# EAGLE design Мультивибратор (EAGLE 9.1.3)
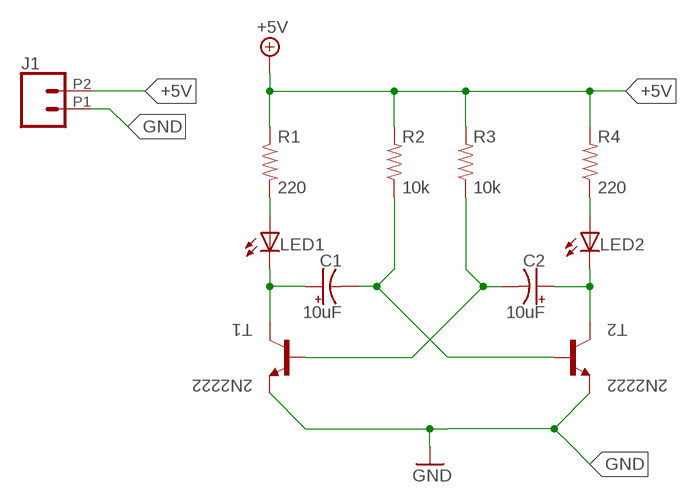
[diagram p0: schematic, sheet 1]

## Parts
C1  10uF  10UF-POLAR-RADIAL-2.5MM-25V-20%  [CPOL-RADIAL-2.5MM-5MM]
C2  10uF  10UF-POLAR-RADIAL-2.5MM-25V-20%  [CPOL-RADIAL-2.5MM-5MM]
J1  CONN_022.54MM_SCREWTERM  [1X02_2.54_SCREWTERM]
LED1  LED5MM  [LED5MM]
LED2  LED5MM  [LED5MM]
R1  220  100OHM-HORIZ-1/4W-1%  [AXIAL-0.3]
R2  10k  100OHM-HORIZ-1/4W-1%  [AXIAL-0.3]
R3  10k  100OHM-HORIZ-1/4W-1%  [AXIAL-0.3]
R4  220  100OHM-HORIZ-1/4W-1%  [AXIAL-0.3]
T1  2N2222  [TO92-EBC-OVAL]
T2  2N2222  [TO92-EBC-OVAL]

## Nets
+5V: J1.P2 R1.P$1 R2.P$2 R3.P$2 R4.P$2
GND: J1.P1 T1.E T2.E
N$1: LED1.A R1.P$2
N$2: C1.1(+) LED1.K(C) T1.C
N$3: C2.1(+) LED2.K(C) T2.C
N$4: LED2.A R4.P$1
N$5: C1.2(-) R2.P$1 T2.B
N$6: C2.2(-) R3.P$1 T1.B

## Library data of the parts
C1 C2 = SparkFun-Capacitors:10UF-POLAR: 10.0µF polarized capacitors A capacitor is a passive two-terminal electrical component used to store electrical energy temporarily in an electric field.; PROD_ID: CAP-08440
J1 = SparkFun-Connectors:CONN_02: Multi connection point. Often used as Generic Header-pin footprint for 0.1 inch spaced/style header connections On any of the 0.1 inch spaced packages, you can populate with these: Break Away Headers - Straight <https://www.sparkfun.com/products/116> (PRT-00116) Break Away Male Headers - Right Angle <https://www.sparkfun.com/products/553> (PRT-00553) Female Headers <https://www.sparkfun.com/products/115> (PRT-00115) Break Away Headers - Machine Pin <https://www.sparkfun.com/products/117> (PRT-00117) Break Away Female Headers - Swiss Machine Pin <https://www.sparkfun.com/products/743> (PRT-00743) For SCREWTERMINALS and SPRING TERMINALS visit here: Screw Terimnals on SparkFun.com <https://www.sparkfun.com/search/results?term=Screw+Terminals> (5mm/3.5mm/2.54mm spacing) This device is also useful as a general connection point to wire up your design to another part of your project. Our various solder wires solder well into these plated through hole pads. Hook-Up Wire - Assortment (Stranded, 22 AWG) <https://www.sparkfun.com/products/11375> (PRT-11375) Hook-Up Wire - Assortment (Solid Core, 22 AWG) <https://www.sparkfun.com/products/11367> (PRT-11367) View the entire wire category on our website here <https://www.sparkfun.com/categories/141> Special notes: Molex polarized connector foot print use with: PRT-08233 with associated crimp pins and housings. 2.54_SCREWTERM for use with PRT-10571. 3.5mm Screw Terminal footprints for PRT-08084 5mm Screw Terminal footprints for use with PRT-08432
LED1 LED2 = adafruit:LED: LED OSRAM: - CHIPLED LG R971, LG N971, LY N971, LG Q971, LY Q971, LO R971, LY R971 LH N974, LH R974 LS Q976, LO Q976, LY Q976 LO Q996 - Hyper CHIPLED LW Q18S LB Q993, LB Q99A, LB R99A - SideLED LS A670, LO A670, LY A670, LG A670, LP A670 LB A673, LV A673, LT A673, LW A673 LH A674 LY A675 LS A676, LA A676, LO A676, LY A676, LW A676 LS A679, LY A679, LG A679 - Hyper Micro SIDELED® LS Y876, LA Y876, LO Y876, LY Y876 LT Y87S - SmartLED LW L88C, LW L88S LB L89C, LB L89S, LG L890 LS L89K, LO L89K, LY L89K LS L896, LA L896, LO L896, LY L896 - TOPLED LS T670, LO T670, LY T670, LG T670, LP T670 LSG T670, LSP T670, LSY T670, LOP T670, LYG T670 LG T671, LOG T671, LSG T671 LB T673, LV T673, LT T673, LW T673 LH T674 LS T676, LA T676, LO T676, LY T676, LB T676, LH T676, LSB T676, LW T676 LB T67C, LV T67C, LT T67C, LS T67K, LO T67K, LY T67K, LW E67C LS E67B, LA E67B, LO E67B, LY E67B, LB E67C, LV E67C, LT E67C LW T67C LS T679, LY T679, LG T679 LS T770, LO T770, LY T770, LG T770, LP T770 LB T773, LV T773, LT T773, LW T773 LH T774 LS E675, LA E675, LY E675, LS T675 LS T776, LA T776, LO T776, LY T776, LB T776 LHGB T686 LT T68C, LB T68C - Hyper Mini TOPLED® LB M676 - Mini TOPLED Santana® LG M470 LS M47K, LO M47K, LY M47K Source: http://www.osram.convergy.de/
R1-R4 = SparkFun-Resistors:100OHM: 100Ω resistor A resistor is a passive two-terminal electrical component that implements electrical resistance as a circuit element. Resistors act to reduce current flow, and, at the same time, act to lower voltage levels within circuits. - Wikipedia; PROD_ID: RES-12181; VALUE: 100
T1 T2 = adafruit:2N2222: NPN TRANSISTOR Big oval pads

## Board
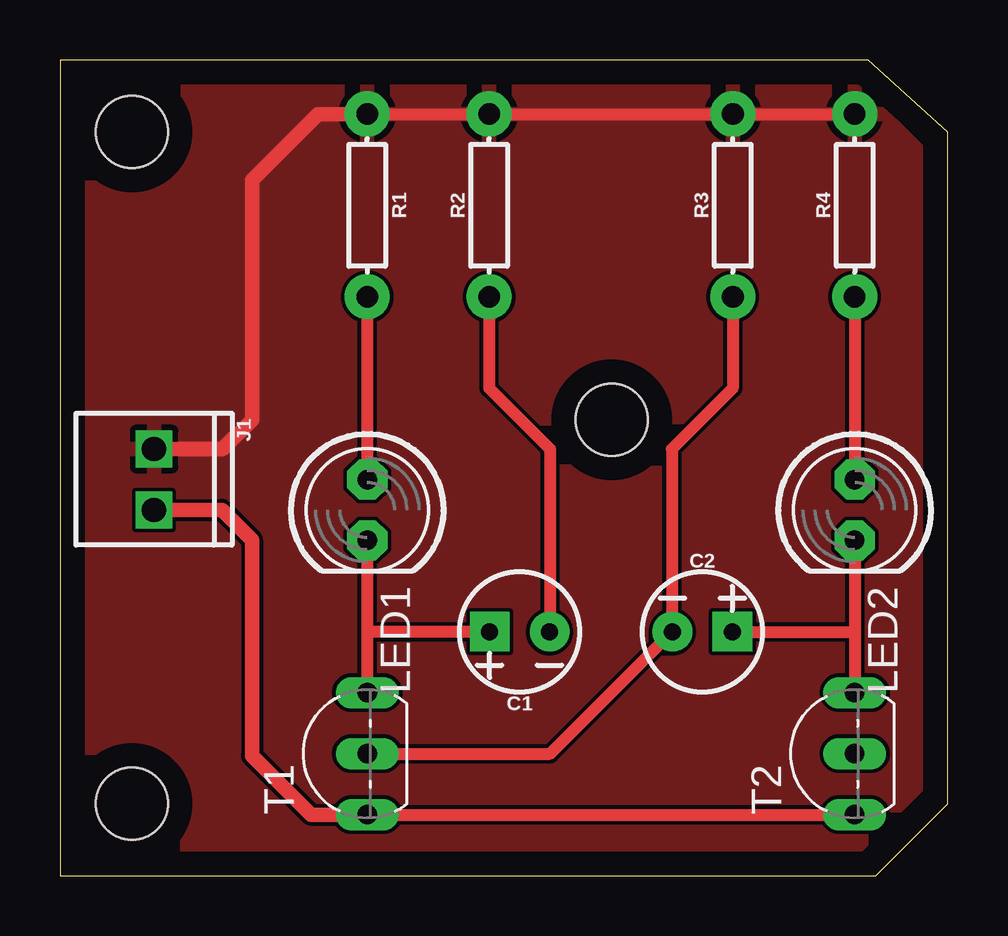
[diagram p1: board, top side]
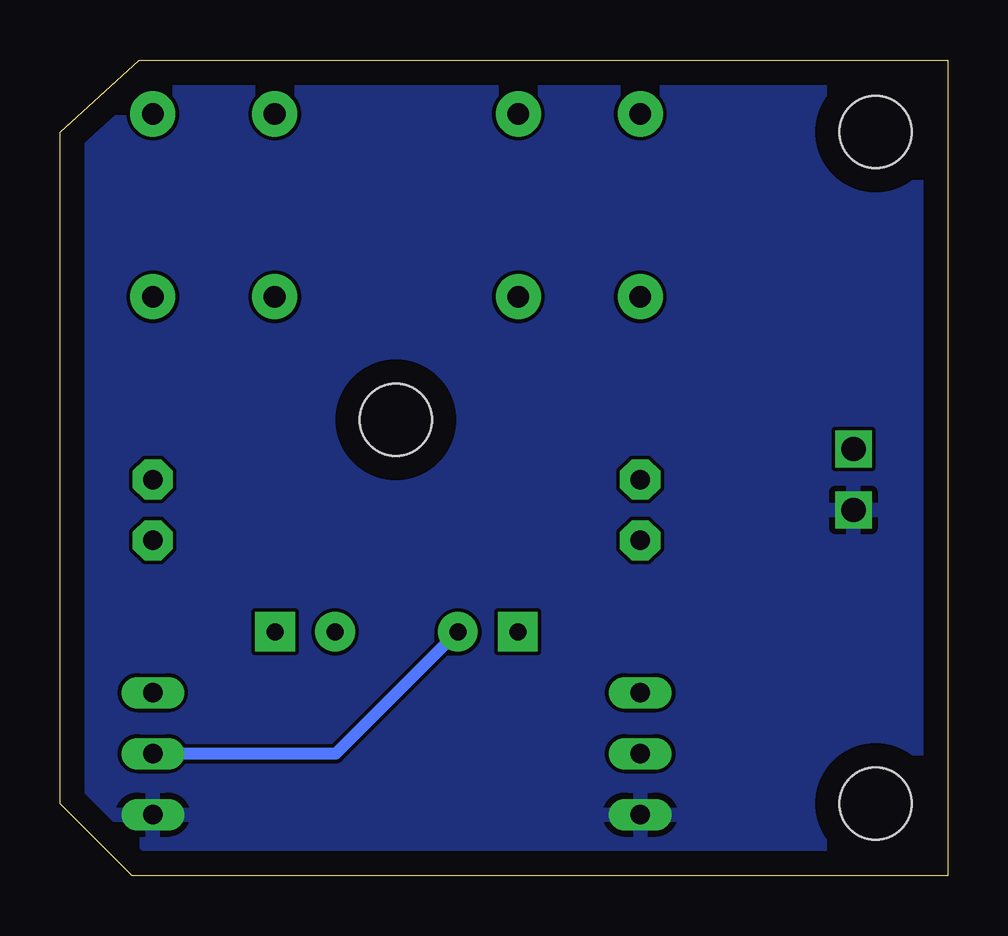
[diagram p2: board, bottom side, seen from below]

Size 37 x 34 mm. Coordinates in mm from the lower left corner, seen from the top.
Outline: 0,0 34,0 37,3 37,31 33.69,34 0,34 0,0
Copper layers (1*16): Top 0.035mm / dielectric 1.5mm / Bottom 0.035mm
Design rules "default": minimum track width 6mil, minimum drill 0.35mm, track to track 6mil, track to pad 6mil, pad to pad 6mil, via to via 6mil, smd to smd 6mil, copper to edge 40mil, drill to drill 6mil, minimum pad ring 10mil, minimum via ring 8mil, stop-mask expansion 4mil, vias tented up to drill 0mil, thermal gap 10mil
Holes 3 mm at 3,31 3,3 23,19

### Footprints (pad centres in the part's own frame; a part is rotated, then mirrored left to right if it is on the bottom)
CPOL-RADIAL-2.5MM-5MM = drill 0.7 pad 1.651 square: 1 1.25,0 | drill 0.7 pad 1.651: 2 -1.25,0
1X02_2.54_SCREWTERM = drill 1.016 square: P1 2.54,0; P2 0,0
LED5MM = drill 0.813 pad 1.676 octagon: A -1.27,0; K 1.27,0
AXIAL-0.3 = drill 0.9 pad 1.88: P$1 -3.81,0; P$2 3.81,0
TO92-EBC-OVAL = drill 0.813 long: B 0,-1.27; C 2.54,-1.27; E -2.54,-1.27

### Placement (x,y rotation side)
C1  19.16,10.16 180 top
C2  26.78,10.16 0 top
J1  3.92,17.78 270 top
LED1  12.81,15.24 270 top
LED2  33.13,15.24 270 top
R1  12.81,27.94 270 top
R2  17.89,27.94 90 top
R3  28.05,27.94 90 top
R4  33.13,27.94 90 top
T1  11.54,5.08 90 top
T2  31.86,5.08 90 top

### Tracks (layer width: path | path; a pad name or v marks a point on that pad's centre or on a via)
+5V
  Top 0.508: R1.P$1 R2.P$2 R3.P$2 R4.P$2
  Top 0.61: R1.P$1 10.75,31.75 8,29 8,19 6.78,17.78 J1.P2
  pour Top: 1,33 33,33 36,30 36,4 33,1 1,1
GND
  Top 0.508: T1.E T2.E
  Top 0.61: J1.P1 6.76,15.24 8,14 8,5 10,3 10.46,2.54 T1.E
  pour Bottom: 1,33 34,33 36,31 36,4 36,3 34,1 1,1
N$1
  Top 0.508: R1.P$2 LED1.A
N$2
  Top 0.508: LED1.K 12.81,10.16 | 12.81,10.16 T1.C | C1.1 12.81,10.16
N$3
  Top 0.508: LED2.K 33.13,10.16 | 33.13,10.16 T2.C | C2.1 33.13,10.16
N$4
  Top 0.508: R4.P$1 LED2.A
N$5
  Top 0.508: R2.P$1 17.89,20.32 20.43,17.78 20.43,10.18 C1.2
  Bottom 0.508: C1.2 20.43,10.16 25.51,5.08 T2.B
N$6
  Top 0.508: R3.P$1 28.05,20.32 25.51,17.78 25.51,10.16 | 25.51,10.16 C2.2 | T1.B 20.43,5.08 25.51,10.16